# EAGLE schematic signal-board (EAGLE 9.6.2)
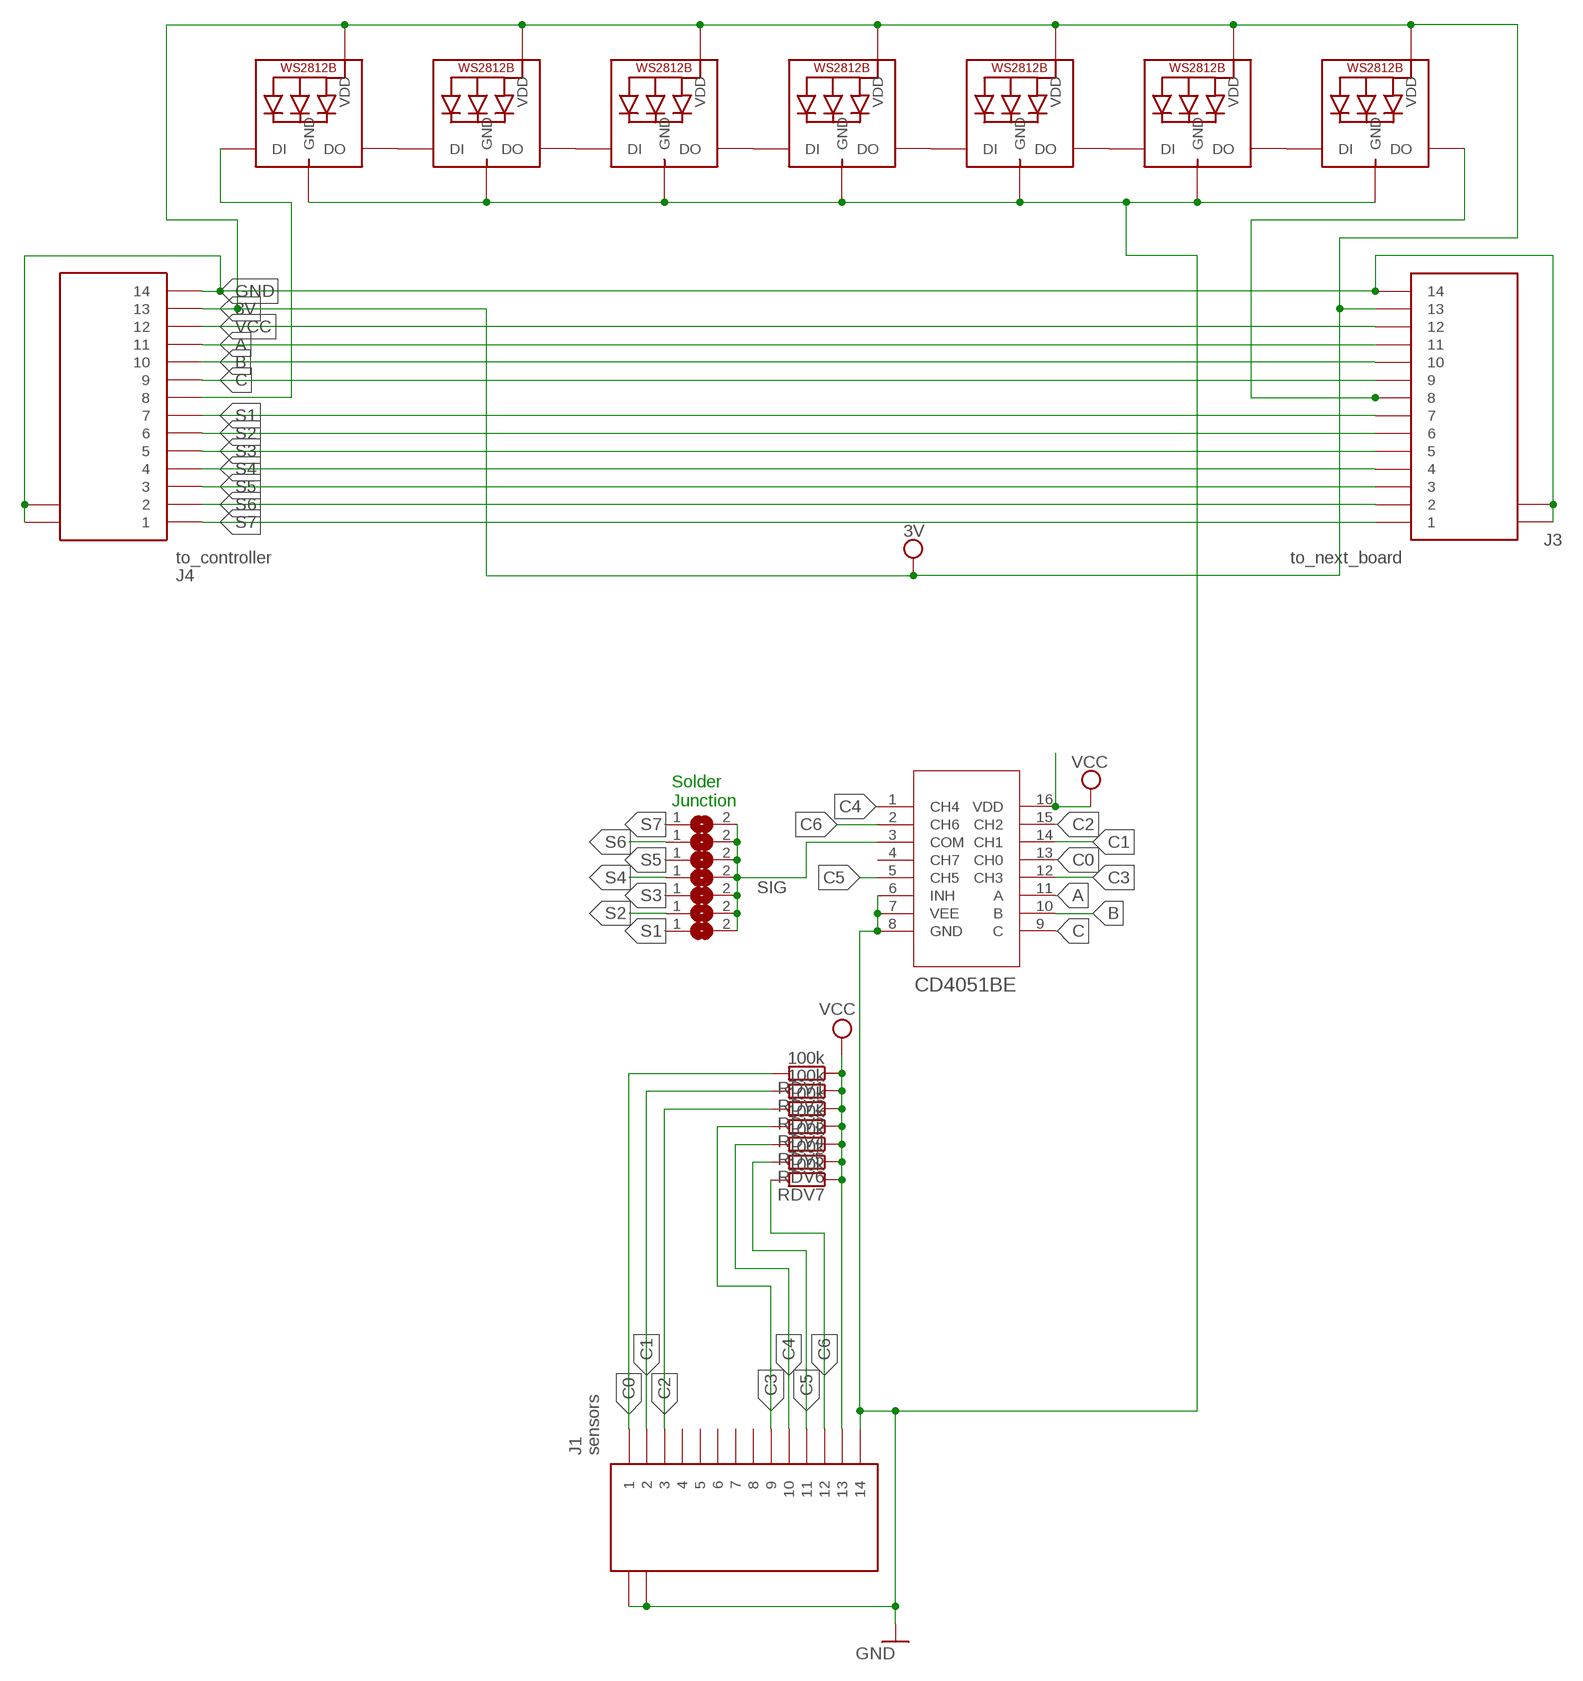
[diagram p0: schematic, sheet 1]

## Parts
J1  sensors  686114148922  [686114148922]
J3  to_next_board  686114148922  [686114148922]
J4  to_controller  686114148922  [686114148922]
LED1  WS2812B3535  [LED3535]
LED2  WS2812B3535  [LED3535]
LED3  WS2812B3535  [LED3535]
LED4  WS2812B3535  [LED3535]
LED5  WS2812B3535  [LED3535]
LED6  WS2812B3535  [LED3535]
LED7  WS2812B3535  [LED3535]
RDV1  100k  R-EU_0207/10  [0207/10]
RDV2  100k  R-EU_0207/10  [0207/10]
RDV3  100k  R-EU_0207/10  [0207/10]
RDV4  100k  R-EU_0207/10  [0207/10]
RDV5  100k  R-EU_0207/10  [0207/10]
RDV6  100k  R-EU_0207/10  [0207/10]
RDV7  100k  R-EU_0207/10  [0207/10]
SJ1  SJ  [SJ]
SJ2  SJ  [SJ]
SJ3  SJ  [SJ]
SJ4  SJ  [SJ]
SJ5  SJ  [SJ]
SJ6  SJ  [SJ]
SJ7  SJ  [SJ]
U1  CD4051BE  [N16]

## Nets
3V: J3.13 J4.13 LED1.2(VDD) LED2.2(VDD) LED3.2(VDD) LED4.2(VDD) LED5.2(VDD) LED6.2(VDD) LED7.2(VDD)
A: J3.11 J4.11 U1.11(A)
B: J3.10 J4.10 U1.10(B)
C: J3.9 J4.9 U1.9(C)
C0: J1.1 RDV1.2 U1.13(CH0)
C1: J1.2 RDV2.2 U1.14(CH1)
C2: J1.3 RDV3.2 U1.15(CH2)
C3: J1.9 RDV4.2 U1.12(CH3)
C4: J1.10 RDV5.2 U1.1(CH4)
C5: J1.11 RDV6.2 U1.5(CH5)
C6: J1.12 RDV7.2 U1.2(CH6)
DIN: J4.8 LED1.1(DI)
DOUT: J3.8 LED7.3(DO)
GND: J1.14 J1.MP1 J1.MP2 J3.14 J3.MP1 J3.MP2 J4.14 J4.MP1 J4.MP2 LED1.4(GND) LED2.4(GND) LED3.4(GND) LED4.4(GND) LED5.4(GND) LED6.4(GND) LED7.4(GND) U1.6(INH) U1.7(VEE) U1.8(GND)
N$1: LED1.3(DO) LED2.1(DI)
N$2: LED2.3(DO) LED3.1(DI)
N$3: LED3.3(DO) LED4.1(DI)
N$4: LED4.3(DO) LED5.1(DI)
N$5: LED5.3(DO) LED6.1(DI)
N$6: LED6.3(DO) LED7.1(DI)
S1: J3.7 J4.7 SJ1.1
S2: J3.6 J4.6 SJ2.1
S3: J3.5 J4.5 SJ3.1
S4: J3.4 J4.4 SJ4.1
S5: J3.3 J4.3 SJ5.1
S6: J3.2 J4.2 SJ6.1
S7: J3.1 J4.1 SJ7.1
SIG: SJ1.2 SJ2.2 SJ3.2 SJ4.2 SJ5.2 SJ6.2 SJ7.2 U1.3(COM)
VCC: J1.13 J3.12 J4.12 RDV1.1 RDV2.1 RDV3.1 RDV4.1 RDV5.1 RDV6.1 RDV7.1 U1.16(VDD)
Unconnected: J1.4 J1.5 J1.6 J1.7 J1.8 U1.4(CH7)

## Notes on the sheet
- Solder
  Junction

## Library data of the parts
J1 J3 J4 = 686114148922:686114148922: Wurth Elektronik WR-FPC 1mm Pitch 14 Way Horizontal SMT Female FPC Connector, ZIF Bottom Contact Source: Datasheet <https://www.we-online.com/catalog/datasheet/686114148922.pdf>; DESCRIPTION: Wurth Elektronik WR-FPC 1mm Pitch 14 Way Horizontal SMT Female FPC Connector, ZIF Bottom Contact; HEIGHT: 2.3mm; MANUFACTURER_NAME: Wurth Elektronik; MANUFACTURER_PART_NUMBER: 686114148922; MOUSER_PART_NUMBER: 710-686114148922; MOUSER_PRICE-STOCK: https://www.mouser.co.uk/ProductDetail/Wurth-Elektronik/686114148922?qs=a9WhcLg8qCz0mPj5zZqo5g%3D%3D
LED1-LED7 = adafruit:WS2812B
RDV1-RDV7 = rcl:R-EU_: RESISTOR, European symbol; SPICEPREFIX: R
SJ1-SJ7 = jumper:SJ: SMD solder JUMPER
U1 = CD4051BE:CD4051BE; COPYRIGHT: Copyright (C) 2024 Ultra Librarian. All rights reserved.; MANUFACTURER_PART_NUMBER: CD4051BE; MFR_NAME: Texas Instruments